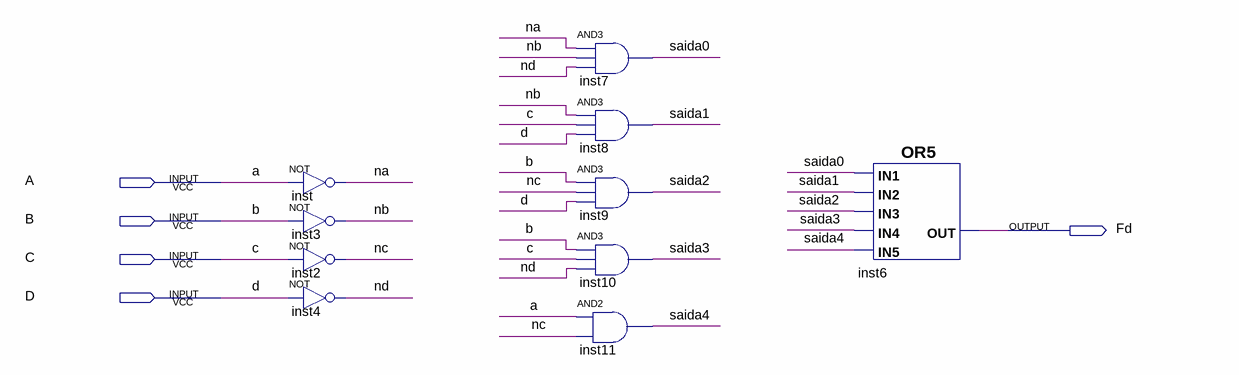
[diagram p0: schematic sheet]
// Quartus schematic FuncaoD.bdf as structural Verilog: 10 symbols, 5 pins
module FuncaoD (
  input  A,
  input  B,
  input  C,
  input  D,
  output Fd
);

  wire na, nb, nc, nd, saida0, saida1, saida2, saida3, saida4;

  not inst (na, A);
  not inst3 (nb, B);
  not inst2 (nc, C);
  not inst4 (nd, D);
  and inst7 (saida0, na, nb, nd);
  and inst8 (saida1, nb, C, D);
  and inst9 (saida2, B, nc, D);
  and inst10 (saida3, B, C, nd);
  and inst11 (saida4, A, nc);
  or inst6 (Fd, saida0, saida1, saida2, saida3, saida4);
endmodule
